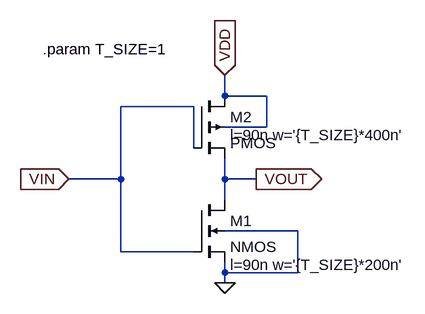
[diagram p0: schematic inverter.asc]
inverter.asc, the LTspice schematic file:
Version 4
SHEET 1 880 680
WIRE 176 -128 176 -160
WIRE 240 -128 176 -128
WIRE 128 -112 16 -112
WIRE 240 -80 240 -128
WIRE 240 -80 176 -80
WIRE 128 -48 128 -112
WIRE 16 0 16 -112
WIRE 16 0 -64 0
WIRE 176 0 176 -32
WIRE 224 0 176 0
WIRE 176 32 176 0
WIRE 288 80 176 80
WIRE 16 112 16 0
WIRE 128 112 16 112
WIRE 176 144 176 128
WIRE 288 144 288 80
WIRE 288 144 176 144
WIRE 176 160 176 144
FLAG 176 160 0
FLAG -64 0 VIN
IOPIN -64 0 In
FLAG 224 0 VOUT
IOPIN 224 0 Out
FLAG 176 -160 VDD
IOPIN 176 -160 In
SYMBOL nmos4 128 32 R0
WINDOW 123 56 100 Left 2
SYMATTR InstName M1
SYMATTR Value2 l=90n w='{T_SIZE}*200n'
SYMBOL pmos4 128 -128 R0
WINDOW 123 56 60 Left 2
SYMATTR InstName M2
SYMATTR Value2 l=90n w='{T_SIZE}*400n'
TEXT -104 -200 Left 2 !.param T_SIZE=1

The netlist it stands for:
* inverter.asc
M1 VOUT VIN 0 0 NMOS l=90n w='{T_SIZE}*200n'
M2 VDD VIN VOUT VDD PMOS l=90n w='{T_SIZE}*400n'
.model NMOS NMOS
.model PMOS PMOS
.lib standard.mos
.param T_SIZE=1
.backanno
.end